# Altium project j15n.PrjPcb
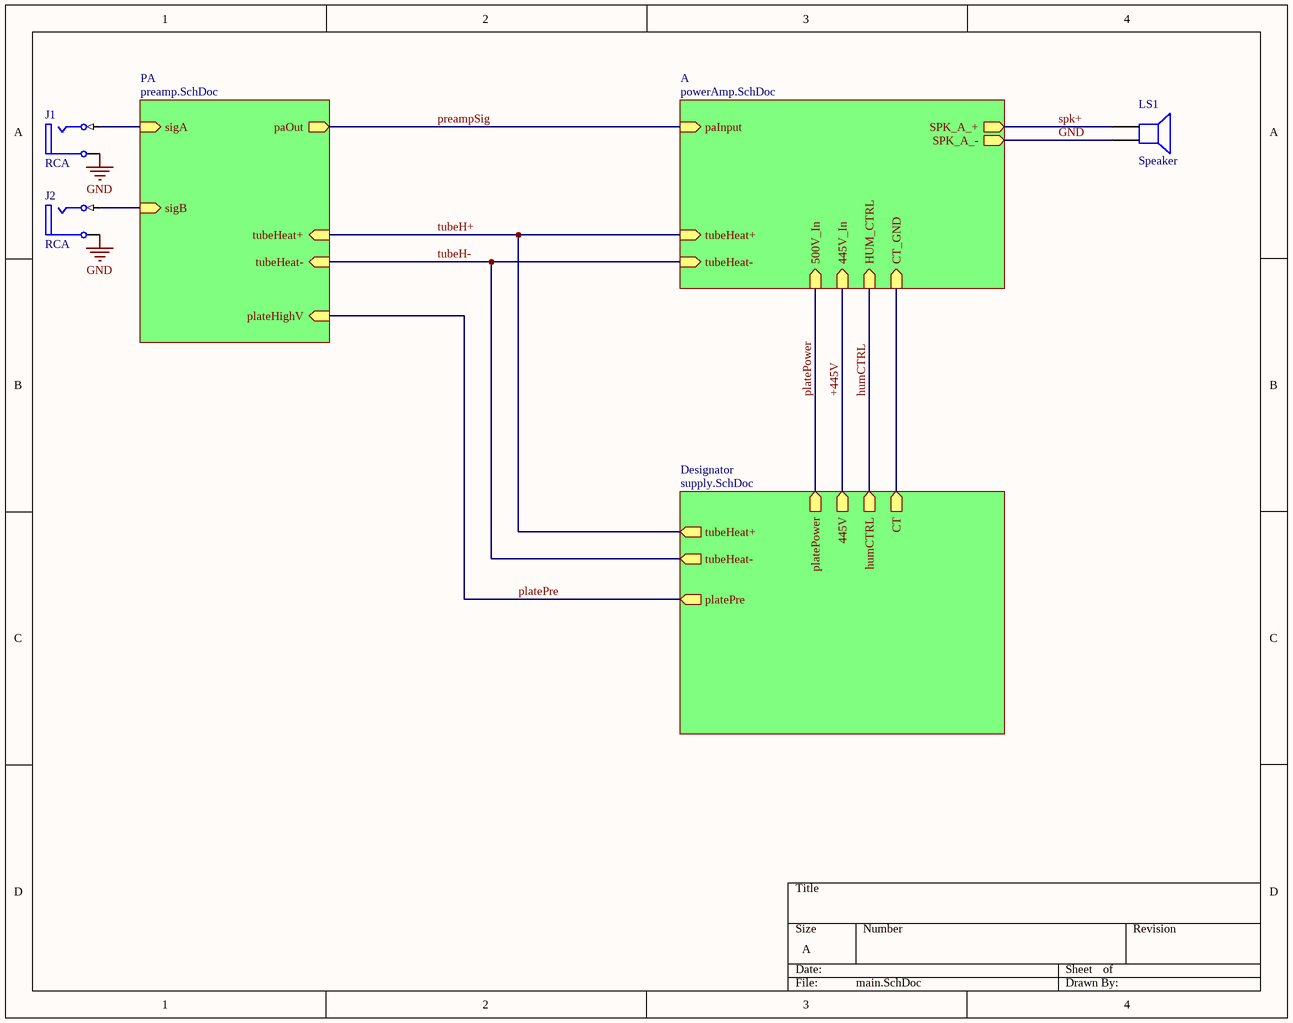
[diagram p0: main.SchDoc]
4 sheets, 72 parts. Net scope: hierarchical (ports join the sheet entries above them; power ports are global).
Board file: ampPcb.PcbDoc
Sheets:
  main.SchDoc
    PA = preamp.SchDoc
    A = powerAmp.SchDoc
    Designator = supply.SchDoc

## Sheet main.SchDoc
size A

### Parts
J1  RCA  [RCA/4.5-H2]
J2  RCA  [RCA/4.5-H2]
LS1  Speaker  [PIN2]

### Sub-sheets
A = powerAmp.SchDoc: paInput (in), 445V_In (in), tubeHeat+ (in), tubeHeat- (in), 500V_In (in), HUM_CTRL (in), CT_GND (in), SPK_A_+ (out), SPK_A_- (out)
Designator = supply.SchDoc: platePre (out), platePower (out), 445V (out), tubeHeat+ (out), humCTRL (out), tubeHeat- (out), CT (out)
PA = preamp.SchDoc: sigA (in), sigB (in), paOut (out), plateHighV (in), tubeHeat+ (in), tubeHeat- (in)

### Nets
GND: J1.1A(Ground) J2.1A(Ground) LS1.2 ; sheet A/SPK_A_-
+445V: sheet A/445V_In, sheet Designator/445V
humCTRL: sheet A/HUM_CTRL, sheet Designator/humCTRL  [project net -50V]
platePower: sheet A/500V_In, sheet Designator/platePower
platePre: sheet PA/plateHighV, sheet Designator/platePre
preampSig: sheet PA/paOut, sheet A/paInput
spk+: LS1.1 ; sheet A/SPK_A_+
tubeH+: sheet PA/tubeHeat+, sheet A/tubeHeat+, sheet Designator/tubeHeat+
tubeH-: sheet PA/tubeHeat-, sheet A/tubeHeat-, sheet Designator/tubeHeat-
NetC1_2: J1.2B(Signal) ; sheet PA/sigA
NetC17_2: sheet A/CT_GND, sheet Designator/CT
NetJ2_2B: J2.2B(Signal) ; sheet PA/sigB

### Library data of the parts
J1 J2 = RCA: RCA Phono Jack, Right Angle, Thru-Hole, Snap-In; PCB_Layout: Complies with manufacturer's recommendation.; DrillAndSlotSize: Corresponds to nominal value.; Published: 15-Jul-2004; LatestRevisionDate: 15-Jul-2004; LatestRevisionNote: Component Replaced.; DatasheetDocument: 7-Jul-2000; PackageDocument: 7-Jul-2000; PackageReference: 161; Publisher: Altium Limited; ComponentLink1Description: Manufacturer Link; ComponentLink1URL: http://www.mouser.com/kobiconn/
LS1 = Speaker: Loudspeaker; Published: 24-Mar-1999; LatestRevisionDate: 17-Jul-2002; LatestRevisionNote: Re-released for DXP Platform.; PackageReference: PIN2; Publisher: Altium Limited

## Sheet preamp.SchDoc
size B
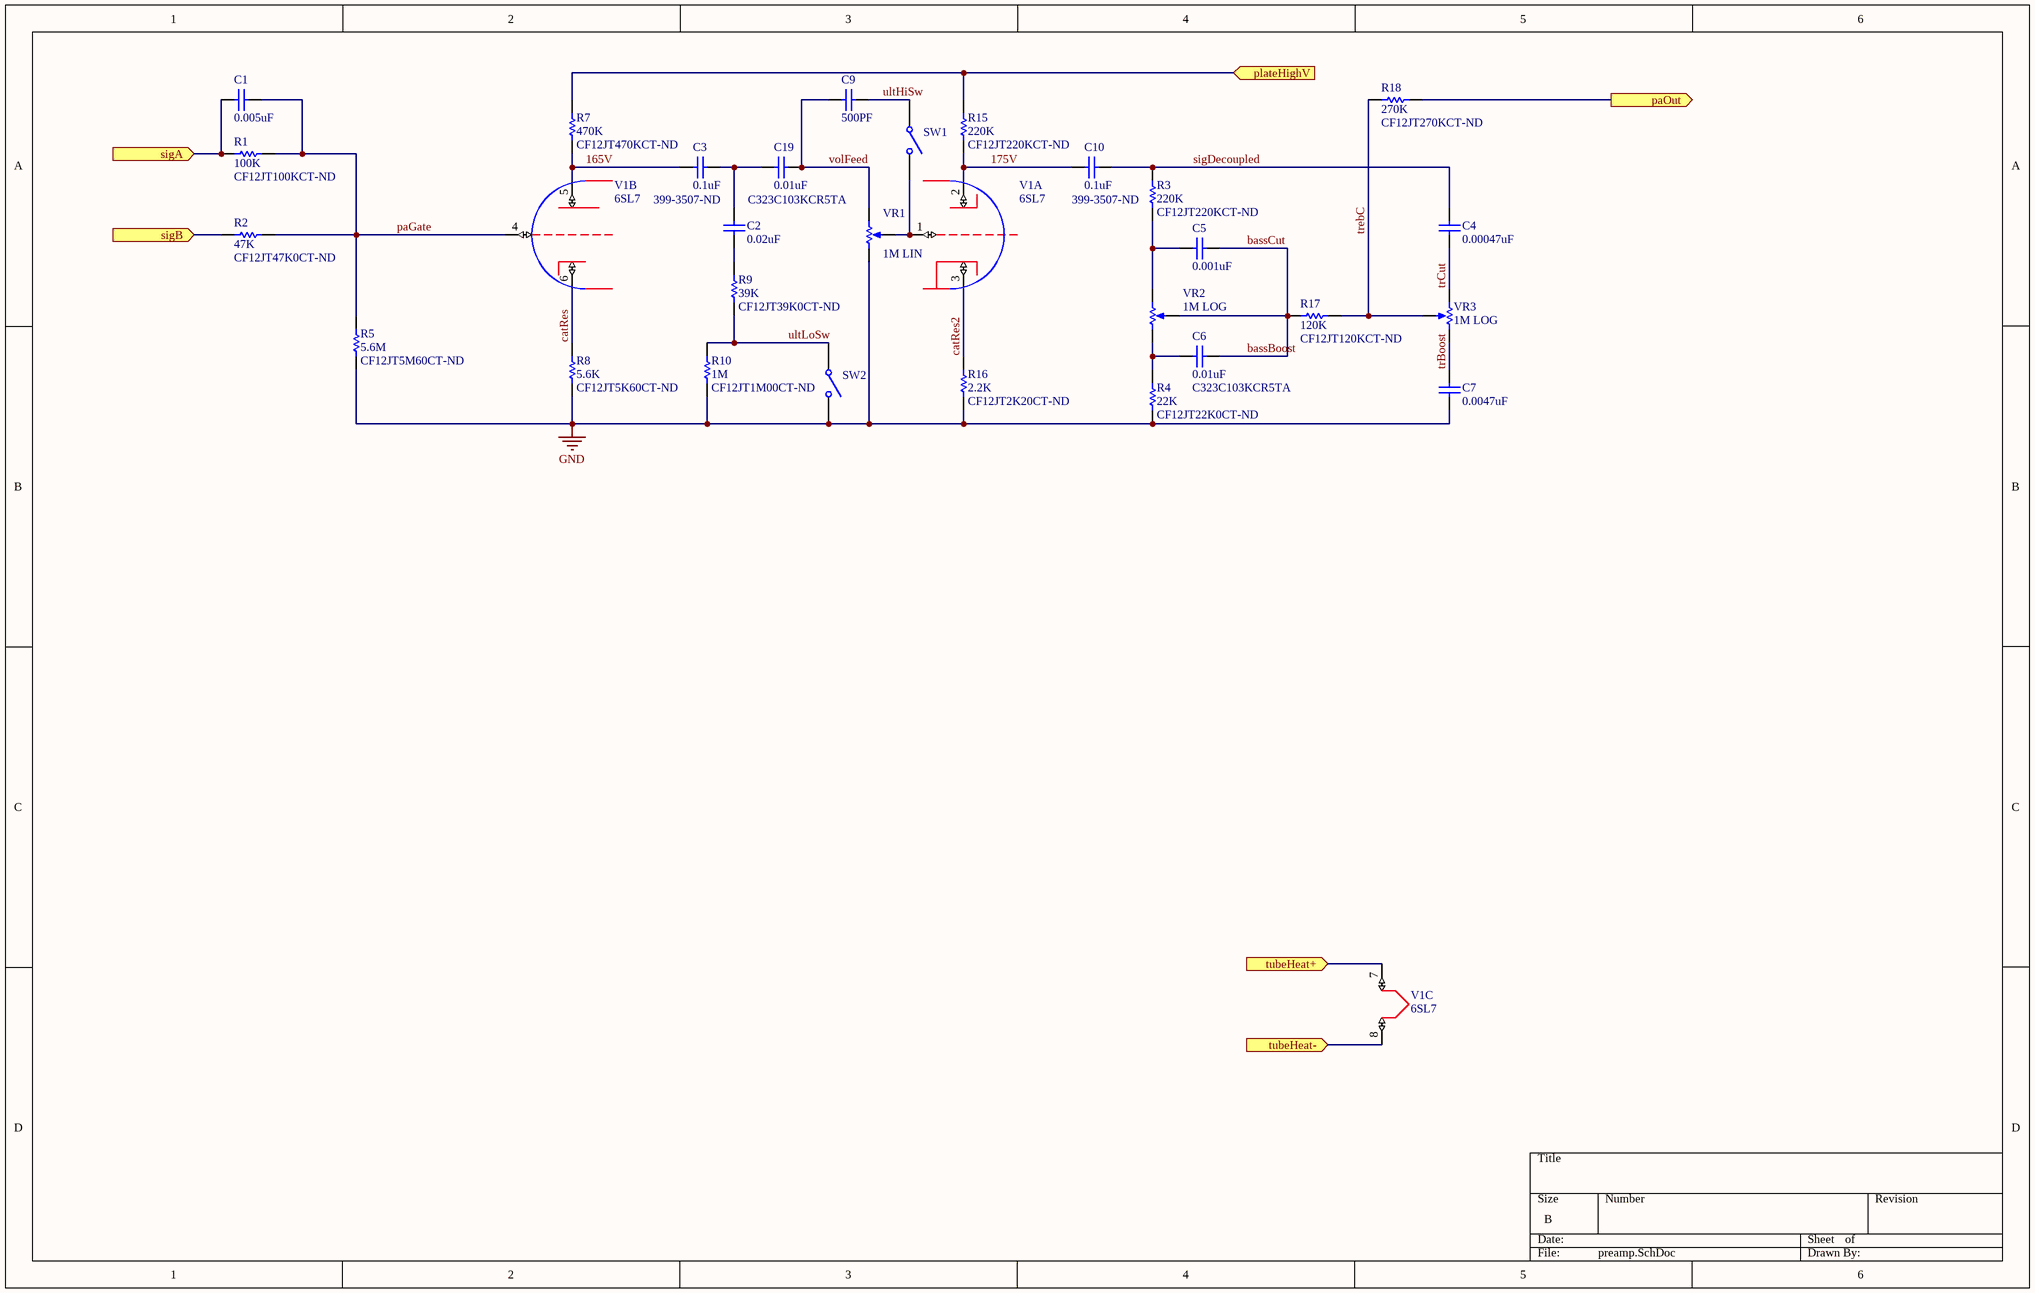
[diagram p1: preamp.SchDoc]

### Parts
C1  value 0.005uF  [RAD-0.3]  (hidden comment: Cap)
C2  value 0.02uF  [RAD-0.3]  (hidden comment: Cap)
C3  value 0.1uF  Supplier Part Number 1: 399-3507-ND  [RAD-0.3]  (hidden comment: Cap)
C4  value 0.00047uF  [RAD-0.3]  (hidden comment: Cap)
C5  value 0.001uF  [RAD-0.3]  (hidden comment: Cap)
C6  value 0.01uF  Supplier Part Number 1: C323C103KCR5TA  [RAD-0.3]  (hidden comment: Cap)
C7  value 0.0047uF  [RAD-0.3]  (hidden comment: Cap)
C9  value 500PF  [RAD-0.3]  (hidden comment: Cap)
C10  value 0.1uF  Supplier Part Number 1: 399-3507-ND  [RAD-0.3]  (hidden comment: Cap)
C19  value 0.01uF  Supplier Part Number 1: C323C103KCR5TA  [RAD-0.3]  (hidden comment: Cap)
R1  value 100K  Supplier Part Number 1: CF12JT100KCT-ND  [AXIAL-0.3]  (hidden comment: Res1)
R2  value 47K  Supplier Part Number 1: CF12JT47K0CT-ND  [AXIAL-0.3]  (hidden comment: Res1)
R3  value 220K  Supplier Part Number 1: CF12JT220KCT-ND  [AXIAL-0.3]  (hidden comment: Res1)
R4  value 22K  Supplier Part Number 1: CF12JT22K0CT-ND  [AXIAL-0.3]  (hidden comment: Res1)
R5  value 5.6M  Supplier Part Number 1: CF12JT5M60CT-ND  [AXIAL-0.3]  (hidden comment: Res1)
R7  value 470K  Supplier Part Number 1: CF12JT470KCT-ND  [AXIAL-0.3]  (hidden comment: Res1)
R8  value 5.6K  Supplier Part Number 1: CF12JT5K60CT-ND  [AXIAL-0.3]  (hidden comment: Res1)
R9  value 39K  Supplier Part Number 1: CF12JT39K0CT-ND  [AXIAL-0.3]  (hidden comment: Res1)
R10  value 1M  Supplier Part Number 1: CF12JT1M00CT-ND  [AXIAL-0.3]  (hidden comment: Res1)
R15  value 220K  Supplier Part Number 1: CF12JT220KCT-ND  [AXIAL-0.3]  (hidden comment: Res1)
R16  value 2.2K  Supplier Part Number 1: CF12JT2K20CT-ND  [AXIAL-0.3]  (hidden comment: Res1)
R17  value 120K  Supplier Part Number 1: CF12JT120KCT-ND  [AXIAL-0.3]  (hidden comment: Res1)
R18  value 270K  Supplier Part Number 1: CF12JT270KCT-ND  [AXIAL-0.3]  (hidden comment: Res1)
SW1  SW-SPST  [SPST-2]  (value not drawn)
SW2  SW-SPST  [SPST-2]  (value not drawn)
V1  6SL7  [OCTALSOCKET]  (parts A,B,C of 3)
VR1  value 1M LIN  [VR5]  (hidden comment: RPot)
VR2  value 1M LOG  [VR5]  (hidden comment: RPot)
VR3  value 1M LOG  [VR5]  (hidden comment: RPot)

### Ports
paOut (out), plateHighV (in), sigA (in), sigB (in), tubeHeat+ (in), tubeHeat- (in)

### Nets
GND: C7.1 R4.1 R5.1 R8.1 R10.1 R16.1 SW2.2(NO) VR1.1(TOP)
165V: C3.1 R7.1 V1.5(topPlate)
175V: C10.1 R15.1 V1.2(topPlate)
bassBoost: C5.2 C6.2 R17.1 VR2.3(TAP)  [also labelled bassCut]
catRes: R8.2 V1.6(topPlate)
catRes2: R16.2 V1.3(topPlate)
paGate: C1.1 R1.2 R2.2 R5.2 V1.4(gate)
platePre: R7.2 R15.2 ; port plateHighV
preampSig: R18.2 ; port paOut
sigDecoupled: C4.2 C10.2 R3.2
trBoost: C7.2 VR3.2(BOT)
trCut: C4.1 VR3.1(TOP)
trebC: R17.2 R18.1 VR3.3(TAP)
tubeH+: V1.7 ; port tubeHeat+
tubeH-: V1.8 ; port tubeHeat-
ultHiSw: C9.1 SW1.1(COMMON)
ultLoSw: R9.1 R10.2 SW2.1(COMMON)
volFeed: C9.2 C19.2 VR1.2(BOT)
NetC1_2: C1.2 R1.1 ; port sigA
NetC2_1: C2.1 R9.2
NetC2_2: C2.2 C3.2 C19.1
NetC5_1: C5.1 R3.1 VR2.2(BOT)
NetC6_1: C6.1 R4.2 VR2.1(TOP)
NetJ2_2B: R2.1 ; port sigB
NetSW1_2: SW1.2(NO) V1.1(gate) VR1.3(TAP)

### Library data of the parts
C1-C7 C9 C10 C19 = Cap: Capacitor; Published: 8-Jun-2000; LatestRevisionDate: 17-Jul-2002; LatestRevisionNote: Re-released for DXP Platform.; PackageReference: RAD-0.3; Publisher: Altium Limited; PackageDescription: Radial Cap, Thru-Hole; 2 Leads; 0.3 in Pin Spacing
  C3 C6 C10 C19: Supplier 1: Digi-Key
R1-R5 R7-R10 R15-R18 = Res1: Resistor; Published: 8-Jun-2000; LatestRevisionDate: 17-Jul-2002; LatestRevisionNote: Re-released for DXP Platform.; PackageReference: AXIAL-0.3; Publisher: Altium Limited; PackageDescription: Axial Device, Thru-Hole; 2 Leads; 0.3 in Pin Spacing; Supplier 1: Digi-Key
SW1 SW2 = SW-SPST: Single-Pole, Single-Throw Switch; Published: 24-Mar-1999; LatestRevisionDate: 17-Jul-2002; LatestRevisionNote: Re-released for DXP Platform.; PackageReference: SPST-2; Publisher: Altium Limited; PackageDescription: Switch; 2 Leads
VR1-VR3 = RPot: Potentiometer; Sim Note: Enter the Resistance value and the set point into parameter fields.; Set Position: 0.5; Published: 8-Jun-2000; LatestRevisionDate: 17-Jul-2002; LatestRevisionNote: Re-released for DXP Platform.; PackageReference: VR5; Publisher: Altium Limited; PackageDescription: Variable Resistor, Thru-Hole; 3 Leads

## Sheet powerAmp.SchDoc
size B
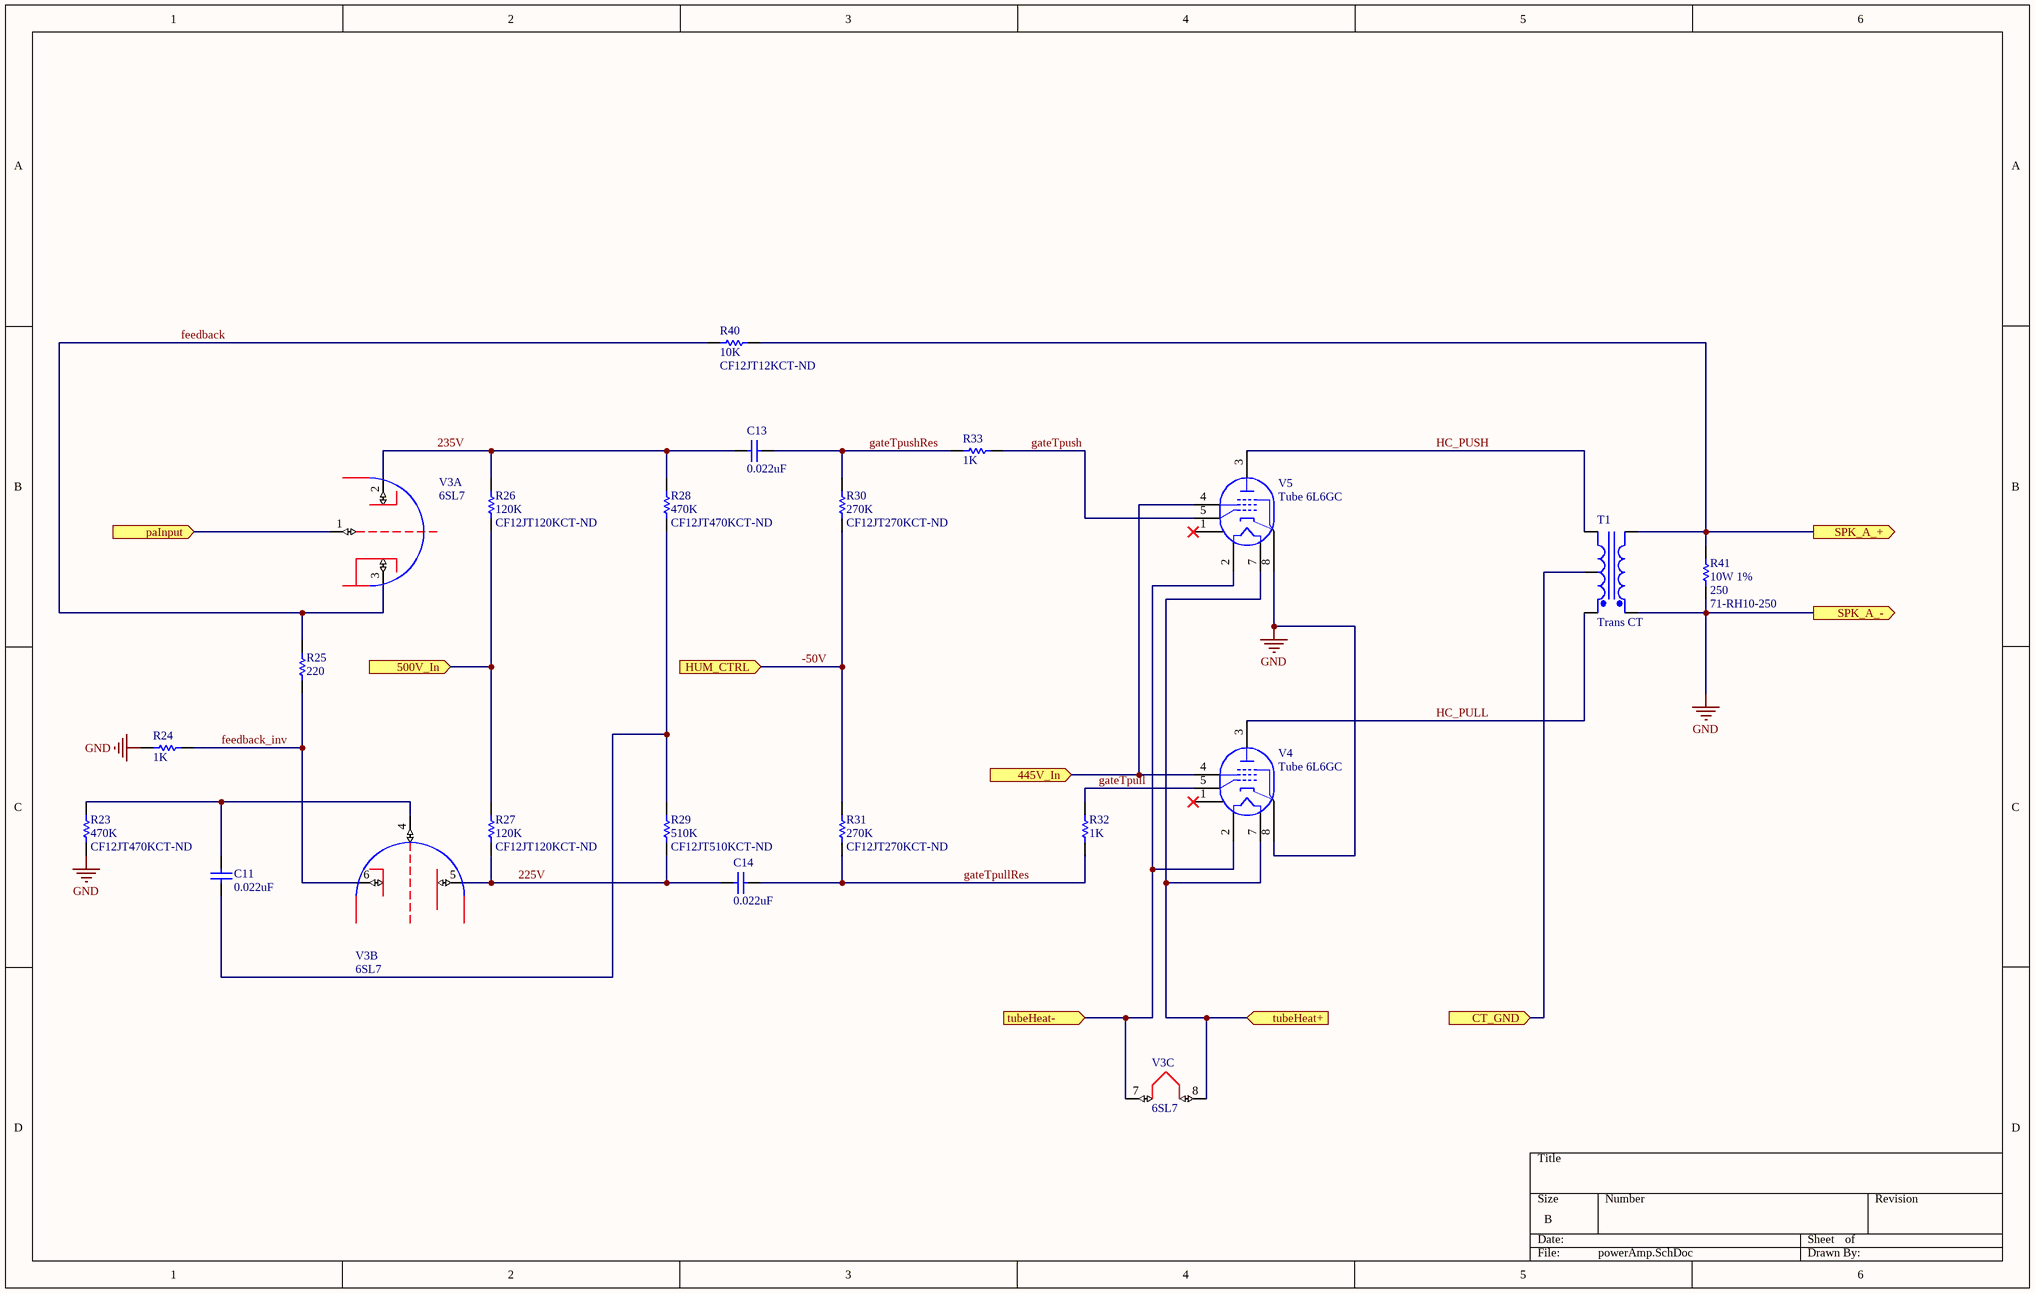
[diagram p2: powerAmp.SchDoc]

### Parts
C11  value 0.022uF  [RAD-0.3]  (hidden comment: Cap)
C13  value 0.022uF  [RAD-0.3]  (hidden comment: Cap)
C14  value 0.022uF  [RAD-0.3]  (hidden comment: Cap)
R23  value 470K  Supplier Part Number 1: CF12JT470KCT-ND  [AXIAL-0.3]  (hidden comment: Res1)
R24  value 1K  [AXIAL-0.3]  (hidden comment: Res1)
R25  value 220  [AXIAL-0.3]  (hidden comment: Res1)
R26  value 120K  Supplier Part Number 1: CF12JT120KCT-ND  [AXIAL-0.3]  (hidden comment: Res1)
R27  value 120K  Supplier Part Number 1: CF12JT120KCT-ND  [AXIAL-0.3]  (hidden comment: Res1)
R28  value 470K  Supplier Part Number 1: CF12JT470KCT-ND  [AXIAL-0.3]  (hidden comment: Res1)
R29  value 510K  Supplier Part Number 1: CF12JT510KCT-ND  [AXIAL-0.3]  (hidden comment: Res1)
R30  value 270K  Supplier Part Number 1: CF12JT270KCT-ND  [AXIAL-0.3]  (hidden comment: Res1)
R31  value 270K  Supplier Part Number 1: CF12JT270KCT-ND  [AXIAL-0.3]  (hidden comment: Res1)
R32  value 1K  [AXIAL-0.3]  (hidden comment: Res1)
R33  value 1K  [AXIAL-0.3]  (hidden comment: Res1)
R40  value 10K  Supplier Part Number 1: CF12JT12KCT-ND  [AXIAL-0.3]  (hidden comment: Res1)
R41  10W 1%  value 250  Supplier Part Number 1: 71-RH10-250  [AXIAL-0.3]
T1  Trans CT  [HDR1X5]
V3  6SL7  [OCTALSOCKET]  (parts A,B,C of 3)
V4  Tube 6L6GC  [OCTALSOCKET]
V5  Tube 6L6GC  [OCTALSOCKET]

### Ports
445V_In (in), 500V_In (in), CT_GND (in), HUM_CTRL (in), paInput (in), SPK_A_+ (out), SPK_A_- (out), tubeHeat+ (in), tubeHeat- (in)

### Nets
GND: R23.2 R24.2 R41.1 T1.1(Pri+) V4.8(G3,_KT) V5.8(G3,_KT) ; port SPK_A_-
225V: C14.1 R27.1 R29.2 V3.5(topPlate)
235V: C13.1 R26.2 R28.1 V3.2(topPlate)
+445V: V4.4(GT2) V5.4(GT2) ; port 445V_In
-50V: R30.1 R31.2 ; port HUM_CTRL
feedback: R25.2 R40.2 V3.3(topPlate)
feedback_inv: R24.1 R25.1 V3.6(topPlate)
gateTpull: R32.1 V4.5(GT1)
gateTpullRes: C14.2 R31.1 R32.2
gateTpush: R33.1 V5.5(GT1)
gateTpushRes: C13.2 R30.2 R33.2
HC_PULL: T1.3(Sec+) V4.3(PT)
HC_PUSH: T1.5(Sec-) V5.3(PT)
platePower: R26.1 R27.2 ; port 500V_In
preampSig: V3.1(gate) ; port paInput
spk+: R40.1 R41.2 T1.2(Pri-) ; port SPK_A_+
tubeH+: V3.8 V4.7(H) V5.7(H) ; port tubeHeat+
tubeH-: V3.7 V4.2(H) V5.2(H) ; port tubeHeat-
NetC11_1: C11.1 R28.2 R29.1
NetC11_2: C11.2 R23.1 V3.4(gate)
NetC17_2: T1.4(SecCT) ; port CT_GND

Not connected (* = marked no-connect by the designer): V4 1(NC)*; V5 1(NC)*

### Library data of the parts
C11 C13 C14 = Cap: Capacitor; Published: 8-Jun-2000; LatestRevisionDate: 17-Jul-2002; LatestRevisionNote: Re-released for DXP Platform.; PackageReference: RAD-0.3; Publisher: Altium Limited; PackageDescription: Radial Cap, Thru-Hole; 2 Leads; 0.3 in Pin Spacing
R23-R33 R40 R41 = Res1: Resistor; Published: 8-Jun-2000; LatestRevisionDate: 17-Jul-2002; LatestRevisionNote: Re-released for DXP Platform.; PackageReference: AXIAL-0.3; Publisher: Altium Limited; PackageDescription: Axial Device, Thru-Hole; 2 Leads; 0.3 in Pin Spacing
  R23 R26-R31 R40: Supplier 1: Digi-Key
  R41: Supplier 1: Mouser
T1 = Trans CT: Center-Tapped Transformer (Coupled Inductor Model); Published: 8-Jun-2000; LatestRevisionDate: 17-Jul-2002; LatestRevisionNote: Re-released for DXP Platform.; PackageReference: TRF_5; Publisher: Altium Limited; PackageDescription: Transformer; 5 Leads
V4 V5 = Tube 6L6GC: Beam Power Pentode; Note: Pin 6 is omitted from the tube package, Pin 1 is Not Connected; Published: 8-Jun-2000; LatestRevisionDate: 17-Jul-2002; LatestRevisionNote: Re-released for DXP Platform.; PackageReference: VTUBE-7; Publisher: Altium Limited; PackageDescription: Vacuum Tube; 7 Leads

## Sheet supply.SchDoc
size B
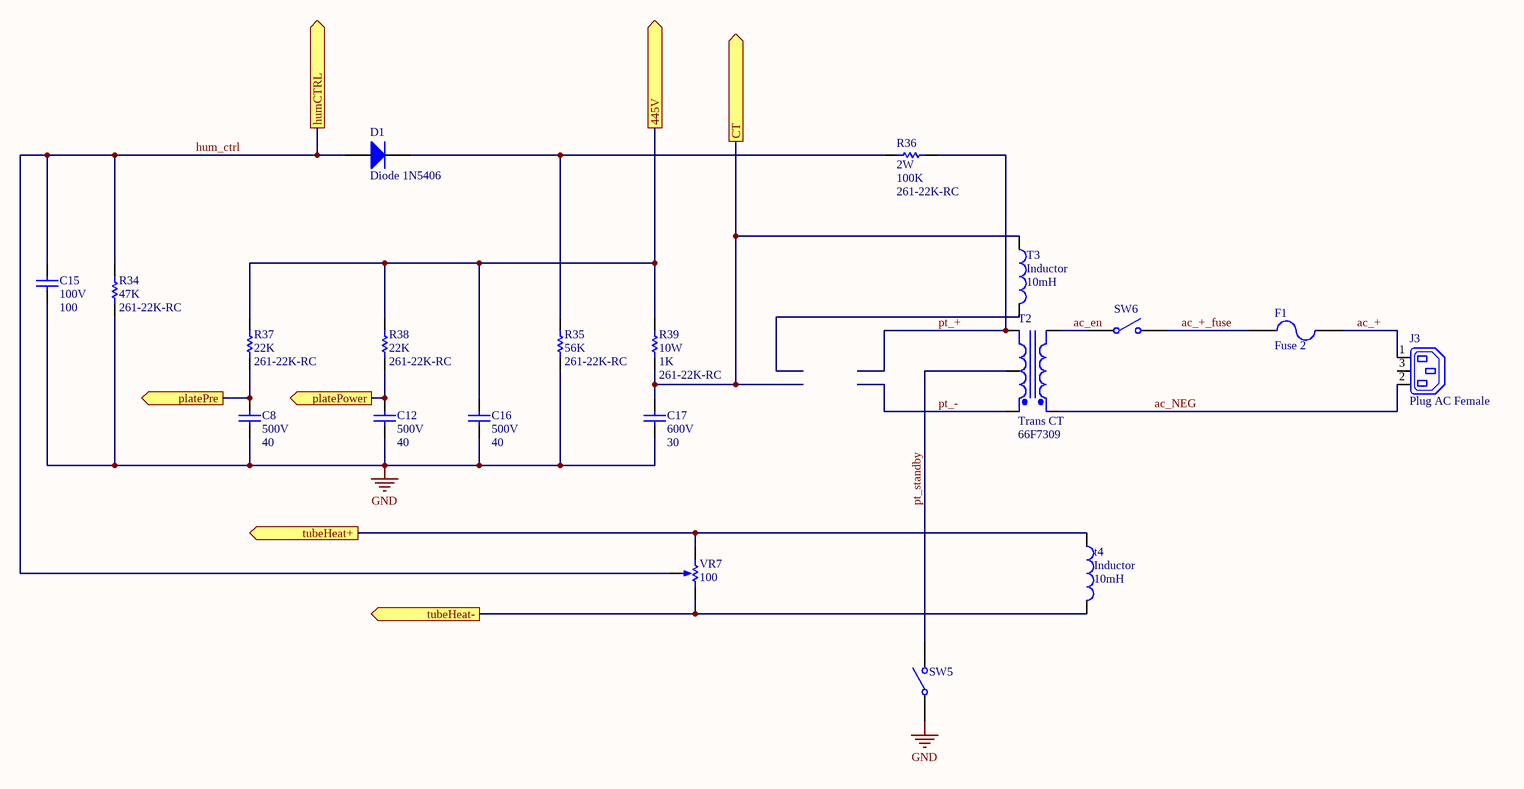
[diagram p3: supply.SchDoc]

### Parts
C8  500V  value 40  [RAD-0.3]
C12  500V  value 40  [RAD-0.3]
C15  100V  value 100  [RAD-0.3]
C16  500V  value 40  [RAD-0.3]
C17  600V  value 30  [RAD-0.3]
D1  Diode 1N5406  [DO-201AD]
F1  Fuse 2  [PIN-W2/E2.8]
J3  Plug AC Female  [IEC7-2H3]
R34  value 47K  Supplier Part Number 1: 261-22K-RC  [AXIAL-0.3]  (hidden comment: Res1)
R35  value 56K  Supplier Part Number 1: 261-22K-RC  [AXIAL-0.3]  (hidden comment: Res1)
R36  2W  value 100K  Supplier Part Number 1: 261-22K-RC  [AXIAL-0.3]
R37  value 22K  Supplier Part Number 1: 261-22K-RC  [AXIAL-0.3]  (hidden comment: Res1)
R38  value 22K  Supplier Part Number 1: 261-22K-RC  [AXIAL-0.3]  (hidden comment: Res1)
R39  10W  value 1K  Supplier Part Number 1: 261-22K-RC  [AXIAL-0.3]
SW5  SW-SPST  [SPST-2]  (value not drawn)
SW6  SW-SPST  [SPST-2]  (value not drawn)
T2  Trans CT  Supplier Part Number 1: 66F7309  [HDR1X5]
T3  Inductor  value 10mH  [HDR1X2]
t4  Inductor  value 10mH  [HDR1X2]
VR7  value 100  [VR5]  (hidden comment: RPot)

### Ports
445V (out), CT (out), humCTRL (out), platePower (out), platePre (out), tubeHeat+ (out), tubeHeat- (out)

### Nets
GND: C8.1 C12.1 C15.1 C16.1 C17.1 R34.1 R35.1 SW5.1(COMMON)
+445V: C16.2 R37.2 R38.2 R39.2 ; port 445V
ac_+: F1.2 J3.1(L)
ac_+_fuse: F1.1 SW6.2(NO)
ac_en: SW6.1(COMMON) T2.2(Pri-)
ac_NEG: J3.2(N) T2.1(Pri+)
hum_ctrl: C15.2 D1.1(A) R34.2 VR7.3(TAP) ; port humCTRL  [project net -50V]
platePower: C12.2 R38.1 ; port platePower
platePre: C8.2 R37.1 ; port platePre
pt_+: R36.1 T2.5(Sec-)
pt_-: T2.3(Sec+)
pt_standby: SW5.2(NO) T2.4(SecCT)
tubeH+: t4.1 VR7.1(TOP) ; port tubeHeat+
tubeH-: t4.2 VR7.2(BOT) ; port tubeHeat-
NetC17_2: C17.2 R39.1 T3.1 ; port CT
NetD1_2: D1.2(K) R35.2 R36.2

Not connected (* = marked no-connect by the designer): J3 3(E); T3 2

### Library data of the parts
C8 C12 C15-C17 = Cap: Capacitor; Published: 8-Jun-2000; LatestRevisionDate: 17-Jul-2002; LatestRevisionNote: Re-released for DXP Platform.; PackageReference: RAD-0.3; Publisher: Altium Limited; PackageDescription: Radial Cap, Thru-Hole; 2 Leads; 0.3 in Pin Spacing
D1 = Diode 1N5406: 3 Amp General Purpose Rectifier; Published: 8-Jun-2000; LatestRevisionDate: 17-Jul-2002; LatestRevisionNote: Re-released for DXP Platform.; DatasheetVersion: 1998; PackageVersion: Aug-1999; PackageReference: DO-201AD; Publisher: Altium Limited; PackageDescription: Diode, Axial; Body 9.5 x 5.6 mm (LxDia. max), Lead Dia. 1.32 mm (max); ComponentLink1Description: Manufacturer Link; ComponentLink1URL: http://www.fairchildsemi.com/; ComponentLink2Description: Datasheet; ComponentLink2URL: http://www.fairchildsemi.com/ds/1N%2F1N5400.pdf
F1 = Fuse 2: Fuse; Published: 8-Jun-2000; LatestRevisionDate: 17-Jul-2002; LatestRevisionNote: Re-released for DXP Platform.; PackageReference: PIN-W2/E2.8; Publisher: Altium Limited; PackageDescription: Thru-Hole; 2 Leads
J3 = Plug AC Female: IEC Mains Power Outlet, EN60 320-2-2 F Class I, PC Flange Rear Mount, Chassis Socket; PackageDocument: ver.80, 15-Sep-2003; MaximumRating: 10A, 250V a.c. (UL & CSA 15A, 250V a.c.); MountingFixtures: Not drawn on schematic symbol.; PCB_Layout: Complies with manufacturer's recommendation.; DrillSize: Corresponds to nominal value.; Published: 15-Jul-2004; LatestRevisionDate: 15-Jul-2004; LatestRevisionNote: Component Replaced & renamed from "Phonejack".; DatasheetDocument: ver.80, 15-Sep-2003; PackageReference: PX0675/PC; Publisher: Altium Limited; Terminations: P.C. Spills; ComponentLink1Description: Manufacturer Link; ComponentLink1URL: http://www.bulgin.co.uk/
R34-R39 = Res1: Resistor; Published: 8-Jun-2000; LatestRevisionDate: 17-Jul-2002; LatestRevisionNote: Re-released for DXP Platform.; PackageReference: AXIAL-0.3; Publisher: Altium Limited; PackageDescription: Axial Device, Thru-Hole; 2 Leads; 0.3 in Pin Spacing; Supplier 1: Mouser
SW5 SW6 = SW-SPST: Single-Pole, Single-Throw Switch; Published: 24-Mar-1999; LatestRevisionDate: 17-Jul-2002; LatestRevisionNote: Re-released for DXP Platform.; PackageReference: SPST-2; Publisher: Altium Limited; PackageDescription: Switch; 2 Leads
T2 = Trans CT: as T1 on sheet powerAmp; Published: 8-Jun-2000; LatestRevisionDate: 17-Jul-2002; LatestRevisionNote: Re-released for DXP Platform.; PackageReference: TRF_5; Publisher: Altium Limited; PackageDescription: Transformer; 5 Leads; Supplier 1: Newark
T3 t4 = Inductor: Code_IEC: 1005; Published: 8-Jun-2000; LatestRevisionDate: 29-May-2009; LatestRevisionNote: IPC-7351 Footprint Added.; PackageReference: 0402-A; Publisher: Altium Limited; PackageDescription: Chip Inductor; Code_JEITA: 0402
VR7 = RPot: as VR1 on sheet preamp; Published: 8-Jun-2000; LatestRevisionDate: 17-Jul-2002; LatestRevisionNote: Re-released for DXP Platform.; PackageReference: VR5; Publisher: Altium Limited; PackageDescription: Variable Resistor, Thru-Hole; 3 Leads

## Nets that join several sheets
GND: main (J1.1A J2.1A LS1.2), preamp (8 pins), powerAmp (6 pins), supply (8 pins)
+445V: powerAmp (V4.4 V5.4), supply (C16.2 R37.2 R38.2 R39.2)
-50V: powerAmp (R30.1 R31.2), supply (C15.2 D1.1 R34.2 VR7.3)
NetC1_2: main (J1.2B), preamp (C1.2 R1.1)
NetC17_2: powerAmp (T1.4), supply (C17.2 R39.1 T3.1)
NetJ2_2B: main (J2.2B), preamp (R2.1)
platePower: powerAmp (R26.1 R27.2), supply (C12.2 R38.1)
platePre: preamp (R7.2 R15.2), supply (C8.2 R37.1)
preampSig: preamp (R18.2), powerAmp (V3.1)
spk+: main (LS1.1), powerAmp (R40.1 R41.2 T1.2)
tubeH+: preamp (V1.7), powerAmp (V3.8 V4.7 V5.7), supply (t4.1 VR7.1)
tubeH-: preamp (V1.8), powerAmp (V3.7 V4.2 V5.2), supply (t4.2 VR7.2)